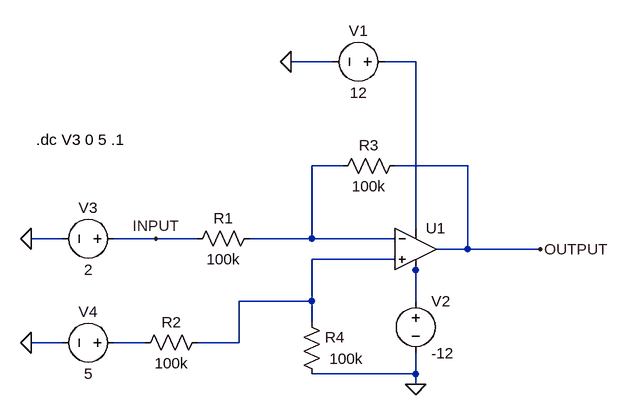
[diagram p0: schematic y_axis_diff_amp.asc]
y_axis_diff_amp.asc, the LTspice schematic file:
Version 4
SHEET 1 880 680
WIRE 112 -96 48 -96
WIRE 240 -96 192 -96
WIRE 128 64 80 64
WIRE 320 64 208 64
WIRE 240 160 240 -96
WIRE -304 176 -352 176
WIRE -160 176 -224 176
WIRE -96 176 -160 176
WIRE 80 176 80 64
WIRE 80 176 -16 176
WIRE 208 176 80 176
WIRE 320 192 320 64
WIRE 320 192 272 192
WIRE 432 192 320 192
WIRE 208 208 80 208
WIRE 240 224 240 208
WIRE 80 272 80 208
WIRE 80 272 -32 272
WIRE 240 272 240 224
WIRE 80 304 80 272
WIRE -304 336 -352 336
WIRE -176 336 -224 336
WIRE -32 336 -32 272
WIRE -32 336 -96 336
WIRE 240 384 240 352
WIRE 240 384 80 384
WIRE 240 400 240 384
FLAG 48 -96 0
FLAG 432 192 OUTPUT
FLAG -352 176 0
FLAG -352 336 0
FLAG 240 400 0
FLAG -160 176 INPUT
SYMBOL OpAmps\\UniversalOpamp2 240 192 R0
SYMATTR InstName U1
SYMBOL voltage 208 -96 R90
WINDOW 0 -32 56 VBottom 2
WINDOW 3 32 56 VTop 2
SYMATTR InstName V1
SYMATTR Value 12
SYMBOL res 224 48 R90
WINDOW 0 0 56 VBottom 2
WINDOW 3 32 56 VTop 2
SYMATTR InstName R3
SYMATTR Value 100k
SYMBOL voltage -208 176 R90
WINDOW 0 -32 56 VBottom 2
WINDOW 3 32 56 VTop 2
SYMATTR InstName V3
SYMATTR Value 2
SYMBOL res 0 160 R90
WINDOW 0 0 56 VBottom 2
WINDOW 3 32 56 VTop 2
SYMATTR InstName R1
SYMATTR Value 100k
SYMBOL voltage -208 336 R90
WINDOW 0 -32 56 VBottom 2
WINDOW 3 32 56 VTop 2
WINDOW 123 0 0 Left 0
WINDOW 39 0 0 Left 0
SYMATTR InstName V4
SYMATTR Value 5
SYMBOL res 64 288 R0
WINDOW 3 43 73 Left 2
SYMATTR InstName R4
SYMATTR Value 100k
SYMBOL voltage 240 256 R0
SYMATTR InstName V2
SYMATTR Value -12
SYMBOL res -80 320 R90
WINDOW 0 0 56 VBottom 2
WINDOW 3 32 56 VTop 2
SYMATTR InstName R2
SYMATTR Value 100k
TEXT -344 24 Left 2 !.dc V3 0 5 .1

The netlist it stands for:
* y_axis_diff_amp.asc
XU1 N003 N002 N001 N004 OUTPUT level.2 Avol=1Meg GBW=10Meg Slew=10Meg ilimit=25m rail=0 Vos=0 phimargin=45 en=0 enk=0 in=0 ink=0 Rin=500Meg  ; pins IN+ IN- V+ V- OUT
V1 N001 0 12
R3 OUTPUT N002 100k
V3 INPUT 0 2
R1 N002 INPUT 100k
V4 N005 0 5
R4 N003 0 100k
V2 N004 0 -12
R2 N003 N005 100k
.dc V3 0 5 .1
.lib UniversalOpamps2.sub
.backanno
.end